# Altium project VS1053_Eink_MP3.PrjPcb
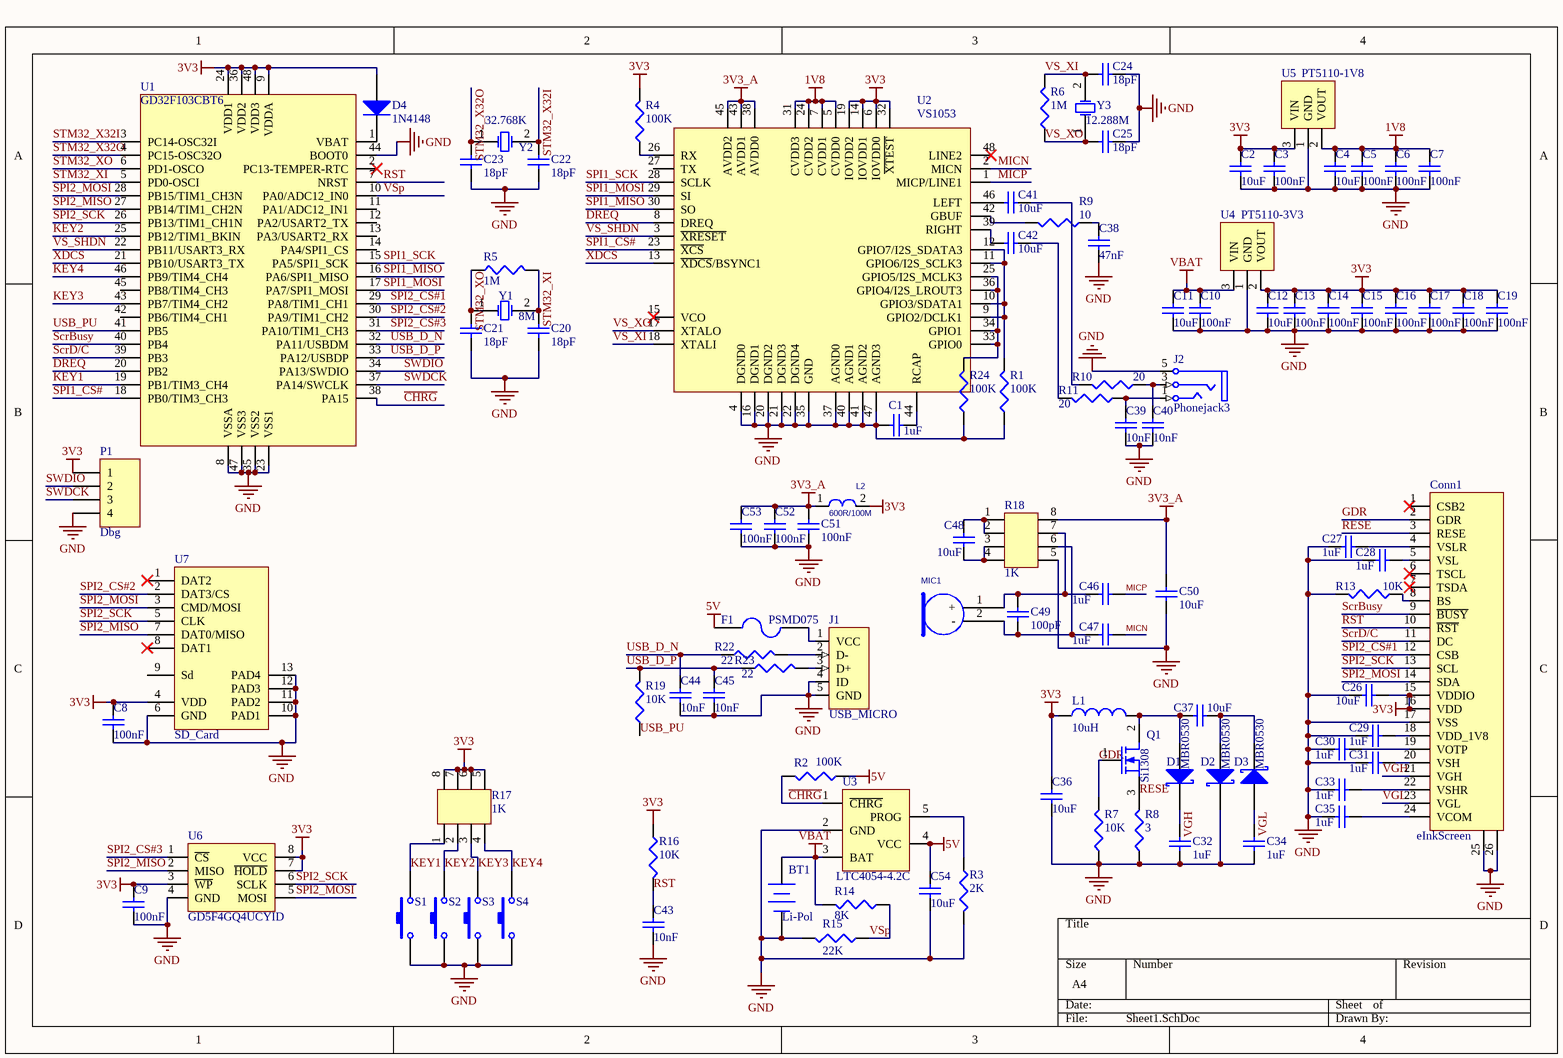
[diagram p0: Sheet1.SchDoc]
1 sheet, 103 parts. Net scope: global (net labels, ports and power ports of the same name join across sheets).
Board file: PCB1.PcbDoc

## Sheet Sheet1.SchDoc
size A4

### Parts
BT1  Li-Pol  [BAT-2]
C1  value 1uF  [0603C]  (hidden comment: Cap)
C2  value 10uF  [0603C]  (hidden comment: Cap)
C3  value 100nF  [0603C]  (hidden comment: Cap)
C4  value 10uF  [0603C]  (hidden comment: Cap)
C5  value 100nF  [0603C]  (hidden comment: Cap)
C6  value 100nF  [0603C]  (hidden comment: Cap)
C7  value 100nF  [0603C]  (hidden comment: Cap)
C8  value 100nF  [0603C]  (hidden comment: Cap)
C9  value 100nF  [0603C]  (hidden comment: Cap)
C10  value 100nF  [0603C]  (hidden comment: Cap)
C11  value 10uF  [0603C]  (hidden comment: Cap)
C12  value 10uF  [0603C]  (hidden comment: Cap)
C13  value 100nF  [0603C]  (hidden comment: Cap)
C14  value 100nF  [0603C]  (hidden comment: Cap)
C15  value 100nF  [0603C]  (hidden comment: Cap)
C16  value 100nF  [0603C]  (hidden comment: Cap)
C17  value 100nF  [0603C]  (hidden comment: Cap)
C18  value 100nF  [0603C]  (hidden comment: Cap)
C19  value 100nF  [0603C]  (hidden comment: Cap)
C20  value 18pF  [0603C]  (hidden comment: Cap)
C21  value 18pF  [0603C]  (hidden comment: Cap)
C22  value 18pF  [0603C]  (hidden comment: Cap)
C23  value 18pF  [0603C]  (hidden comment: Cap)
C24  value 18pF  [0603C]  (hidden comment: Cap)
C25  value 18pF  [0603C]  (hidden comment: Cap)
C26  value 10uF  [0603C]  (hidden comment: Cap)
C27  value 1uF  [0603C]  (hidden comment: Cap)
C28  value 1uF  [0603C]  (hidden comment: Cap)
C29  value 1uF  [0603C]  (hidden comment: Cap)
C30  value 1uF  [0603C]  (hidden comment: Cap)
C31  value 1uF  [0603C]  (hidden comment: Cap)
C32  value 1uF  [0603C]  (hidden comment: Cap)
C33  value 1uF  [0603C]  (hidden comment: Cap)
C34  value 1uF  [0603C]  (hidden comment: Cap)
C35  value 1uF  [0603C]  (hidden comment: Cap)
C36  value 10uF  [0603C]  (hidden comment: Cap)
C37  value 10uF  [0603C]  (hidden comment: Cap)
C38  value 47nF  [0603C]  (hidden comment: Cap)
C39  value 10nF  [0603C]  (hidden comment: Cap)
C40  value 10nF  [0603C]  (hidden comment: Cap)
C41  value 10uF  [0603C]  (hidden comment: Cap)
C42  value 10uF  [0603C]  (hidden comment: Cap)
C43  value 10nF  [0603C]  (hidden comment: Cap)
C44  value 10nF  [0603C]  (hidden comment: Cap)
C45  value 10nF  [0603C]  (hidden comment: Cap)
C46  value 1uF  [0603C]  (hidden comment: Cap)
C47  value 1uF  [0603C]  (hidden comment: Cap)
C48  value 10uF  [0603C]  (hidden comment: Cap)
C49  value 100pF  [0603C]  (hidden comment: Cap)
C50  value 10uF  [0603C]  (hidden comment: Cap)
C51  value 100nF  [0603C]  (hidden comment: Cap)
C52  value 100nF  [0603C]  (hidden comment: Cap)
C53  value 100nF  [0603C]  (hidden comment: Cap)
C54  value 10uF  [0603C]  (hidden comment: Cap)
Conn1  eInkScreen  [FPC-24P-0.5]
D1  MBR0530  [SOD123]
D2  MBR0530  [SOD123]
D3  MBR0530  [SOD123]
D4  1N4148  [0805LED2]
F1  PSMD075  [0805-1R]
J1  USB_MICRO  [MicroUSB]
J2  Phonejack3  [PJ-320B]
L1  value 10uH  [1210R]  (hidden comment: Inductor)
L2  600R/100M  [L0603]
MIC1  Micphone  [mic_4015]  (value not drawn)
P1  Dbg  [HDR1X4]
Q1  Si1308  [SOT323-N]
R1  value 100K  [0603R]  (hidden comment: Res3)
R2  value 100K  [0603R]  (hidden comment: Res3)
R3  value 2K  [0603R]  (hidden comment: Res3)
R4  value 100K  [0603R]  (hidden comment: Res3)
R5  value 1M  [0603R]  (hidden comment: Res3)
R6  value 1M  [0603R]  (hidden comment: Res3)
R7  value 10K  [0603R]  (hidden comment: Res3)
R8  value 3  [0603R]  (hidden comment: Res3)
R9  value 10  [0603R]  (hidden comment: Res3)
R10  value 20  [0603R]  (hidden comment: Res3)
R11  value 20  [0603R]  (hidden comment: Res3)
R13  value 10K  [0603R]  (hidden comment: Res3)
R14  value 8K  [0603R]  (hidden comment: Res3)
R15  value 22K  [0603R]  (hidden comment: Res3)
R16  value 10K  [0603R]  (hidden comment: Res3)
R17  1K  [YC164]
R18  1K  [YC164]
R19  value 10K  [0603R]  (hidden comment: Res3)
R22  value 22  [0603R]  (hidden comment: Res3)
R23  value 22  [0603R]  (hidden comment: Res3)
R24  value 100K  [0603R]  (hidden comment: Res3)
S1  SW-PB  [SPST-2]  (value not drawn)
S2  SW-PB  [SPST-2]  (value not drawn)
S3  SW-PB  [SPST-2]  (value not drawn)
S4  SW-PB  [SPST-2]  (value not drawn)
U1  GD32F103CBT6  [LQFP48-7x7]
U2  VS1053  [LQFP48-7x7]
U3  LTC4054-4.2C  [SOT23-5]
U4  PT5110-3V3  [SOT23]
U5  PT5110-1V8  [SOT23]
U6  GD5F4GQ4UCYID  [TSOP8+WSON8-6X5]
U7  SD_Card  [TF_self-eject]
Y1  8M  [XTAL-5032]
Y2  32.768K  [XTAL-3215]
Y3  12.288M  [XTAL-5032]

### Nets
1V8: C4.1 C5.1 C6.1 C7.1 U2.5(CVDD0) U2.7(CVDD1) U2.24(CVDD2) U2.31(CVDD3) U5.2(VOUT)
3V3: C2.1 C3.1 C8.1 C9.2 C12.2 C13.2 C14.2 C15.2 C16.2 C17.2 C18.2 C19.2 C26.2 C36.2 Conn1.15(VDDIO) Conn1.16(VDD) D4.1(A) L1.1 L2.2 P1.1 R4.2 R16.1 R17.5 R17.6 R17.7 R17.8 U1.9(VDDA) U1.24(VDD1) U1.36(VDD2) U1.48(VDD3) U2.6(IOVDD0) U2.14(IOVDD1) U2.19(IOVDD2) U2.32(~{XTEST}) U4.2(VOUT) U5.3(VIN) U6.3(~{WP}) U6.7(~{HOLD}) U6.8(VCC) U7.4(VDD)
3V3_A: C50.2 C51.2 C52.2 C53.2 L2.1 R18.8 U2.38(AVDD0) U2.43(AVDD1) U2.45(AVDD2)
5V: C54.2 F1.1 R2.1 U3.4(VCC)
GND: BT1.2(-) C1.1 C2.2 C3.2 C4.2 C5.2 C6.2 C7.2 C8.2 C9.1 C10.1 C11.1 C12.1 C13.1 C14.1 C15.1 C16.1 C17.1 C18.1 C19.1 C20.2 C21.2 C22.2 C23.2 C24.2 C25.2 C26.1 C27.1 C28.1 C29.1 C30.1 C31.1 C32.1 C33.1 C34.1 C35.1 C36.1 C38.1 C39.1 C40.1 C43.1 C44.1 C45.1 C50.1 C51.1 C52.1 C53.1 C54.1 Conn1.17(VSS) Conn1.25 Conn1.26 D2.2(K) J1.4(ID) J1.5(GND) J2.5(S) P1.4 R1.1 R3.2 R7.1 R8.1 R13.2 R15.2 R18.5 R24.1 S1.1 S2.1 S3.1 S4.1 U1.8(VSSA) U1.23(VSS1) U1.35(VSS2) U1.44(BOOT0) U1.47(VSS3) U2.4(DGND0) U2.16(DGND1) U2.20(DGND2) U2.21(DGND3) U2.22(DGND4) U2.35(GND) U2.37(AGND0) U2.40(AGND1) U2.41(AGND2) U2.47(AGND3) U3.2(GND) U4.1(GND) U5.1(GND) U6.4(GND) U7.6(GND) U7.10(PAD1) U7.11(PAD2) U7.12(PAD3) U7.13(PAD4)
VBAT: BT1.1(+) C10.2 C11.2 R14.2 U3.3(BAT) U4.3(VIN)
~{CHRG}: R2.2 U1.38(PA15) U3.1(~{CHRG})
DREQ: U1.20(PB2) U2.8(DREQ)
GDR: Conn1.2(GDR) Q1.1(G) R7.2
KEY1: R17.1 S1.2 U1.19(PB1/TIM3_CH4)
KEY2: R17.2 S2.2 U1.25(PB12/TIM1_BKIN)
KEY3: R17.3 S3.2 U1.43(PB7/TIM4_CH2)
KEY4: R17.4 S4.2 U1.46(PB9/TIM4_CH4)
MICN: C47.1 U2.2(MICN)
MICP: C46.1 U2.1(MICP/LINE1)
RESE: Conn1.3(RESE) Q1.3 R8.2
RST: C43.2 Conn1.10(~{RST}) R16.2 U1.7(NRST)
ScrBusy: Conn1.9(~{BUSY}) U1.40(PB4)
ScrD/C: Conn1.11(DC) U1.39(PB3)
SPI1_CS#: U1.18(PB0/TIM3_CH3) U2.23(~{XCS})
SPI1_MISO: U1.16(PA6/SPI1_MISO) U2.30(SO)
SPI1_MOSI: U1.17(PA7/SPI1_MOSI) U2.29(SI)
SPI1_SCK: U1.15(PA5/SPI1_SCK) U2.28(SCLK)
SPI2_CS#1: Conn1.12(CSB) U1.29(PA8/TIM1_CH1)
SPI2_CS#2: U1.30(PA9/TIM1_CH2) U7.2(DAT3/CS)
SPI2_CS#3: U1.31(PA10/TIM1_CH3) U6.1(~{CS})
SPI2_MISO: U1.27(PB14/TIM1_CH2N) U6.2(MISO) U7.7(DAT0/MISO)
SPI2_MOSI: Conn1.14(SDA) U1.28(PB15/TIM1_CH3N) U6.5(MOSI) U7.3(CMD/MOSI)
SPI2_SCK: Conn1.13(SCL) U1.26(PB13/TIM1_CH1N) U6.6(SCLK) U7.5(CLK)
STM32_X32I: C22.1 U1.3(PC14-OSC32I) Y2.2(OSC2)
STM32_X32O: C23.1 U1.4(PC15-OSC32O) Y2.1(OSC1)
STM32_XI: C20.1 R5.2 U1.5(PD0-OSCI) Y1.2(OSC2)
STM32_XO: C21.1 R5.1 U1.6(PD1-OSCO) Y1.1(OSC1)
SWDCK: P1.3 U1.37(PA14/SWCLK)
SWDIO: P1.2 U1.34(PA13/SWDIO)
USB_D_N: C44.2 R22.1 U1.32(PA11/USBDM)
USB_D_P: C45.2 R19.2 R23.1 U1.33(PA12/USBDP)
USB_PU: R19.1 U1.41(PB5)
VGH: C32.2 Conn1.21(VGH) D1.2(K)
VGL: C34.2 Conn1.23(VGL) D3.1(A)
VS_SHDN: U1.22(PB11/USART3_RX) U2.3(~{XRESET})
VS_XI: C24.1 R6.2 U2.18(XTALI) Y3.2(OSC2)
VS_XO: C25.1 R6.1 U2.17(XTALO) Y3.1(OSC1)
VSp: R14.1 R15.1 U1.10(PA0/ADC12_IN0)
XDCS: U1.21(PB10/USART3_TX) U2.13(~{XDCS}/BSYNC1)
NetC1_2: C1.2 U2.44(RCAP)
NetC27_2: C27.2 Conn1.4(VSLR)
NetC28_2: C28.2 Conn1.5(VSL)
NetC29_2: C29.2 Conn1.18(VDD_1V8)
NetC30_2: C30.2 Conn1.19(VOTP)
NetC31_2: C31.2 Conn1.20(VSH)
NetC33_2: C33.2 Conn1.22(VSHR)
NetC35_2: C35.2 Conn1.24(VCOM)
NetC37_1: C37.1 D2.1(A) D3.2(K)
NetC37_2: C37.2 D1.1(A) L1.2 Q1.2
NetC38_2: C38.2 R9.1
NetC39_2: C39.2 J2.1(T) R11.1
NetC40_2: C40.2 J2.3(R) R10.1
NetC41_1: C41.1 R10.2
NetC41_2: C41.2 U2.46(LEFT)
NetC42_1: C42.1 R11.2
NetC42_2: C42.2 U2.39(RIGHT)
NetC46_2: C46.2 C49.2 MIC1.1(+) R18.7
NetC47_2: C47.2 C49.1 MIC1.2(-) R18.6
NetC48_1: C48.1 R18.3 R18.4
NetC48_2: C48.2 R18.1 R18.2
NetConn1_8: Conn1.8(BS) R13.1
NetD4_2: D4.2(K) U1.1(VBAT)
NetF1_2: F1.2 J1.1(VCC)
NetJ1_2: J1.2(D-) R22.2
NetJ1_3: J1.3(D+) R23.2
NetR1_2: R1.2 U2.9(GPIO2/DCLK1) U2.10(GPIO3/SDATA1) U2.11(GPIO6/I2S_SCLK3) U2.12(GPIO7/I2S_SDATA3)
NetR3_1: R3.1 U3.5(PROG)
NetR4_1: R4.1 U2.26(RX)
NetR9_2: R9.2 U2.42(GBUF)
NetR24_2: R24.2 U2.25(GPIO5/I2S_MCLK3) U2.33(GPIO0) U2.34(GPIO1) U2.36(GPIO4/I2S_LROUT3)

Not connected (* = marked no-connect by the designer): Conn1 1(CSB2)* 6(TSCL)* 7(TSDA)*; U1 2(PC13-TEMPER-RTC)* 11(PA1/ADC12_IN1) 12(PA2/USART2_TX) 13(PA3/USART2_RX) 14(PA4/SPI1_CS) 42(PB6/TIM4_CH1) 45(PB8/TIM4_CH3); U2 15(VCO)* 27(TX) 48(LINE2)*; U7 1(DAT2)* 8(DAT1)* 9(Sd)

### Library data of the parts
BT1 = Battery: Multicell Battery; Published: 24-Mar-1999; LatestRevisionDate: 17-Jul-2002; LatestRevisionNote: Re-released for DXP Platform.; PackageReference: BAT-2; Publisher: Altium Limited; PackageDescription: Battery; 2 Leads
C1-C54 = Cap: Capacitor; Published: 8-Jun-2000; LatestRevisionDate: 17-Jul-2002; LatestRevisionNote: Re-released for DXP Platform.; PackageReference: RAD-0.3; Publisher: Altium Limited; PackageDescription: Radial Cap, Thru-Hole; 2 Leads; 0.3 in Pin Spacing
Conn1 = eINK_FPC24
D1-D3 = D Schottky: Schottky Diode; Published: 8-Jun-2000; LatestRevisionDate: 17-Jul-2002; LatestRevisionNote: Re-released for DXP Platform.; PackageReference: SMB; Publisher: Altium Limited; PackageDescription: DO-214-AA/SMB; 2 C-Bend Leads; Body 5.3 x 3.6 mm, inc. leads (LxW); Code_JEDEC: DO-214-AA
D4 = Diode 1N4148: High Conductance Fast Diode; Published: 8-Jun-2000; LatestRevisionDate: 17-Jul-2002; LatestRevisionNote: Re-released for DXP Platform.; DatasheetVersion: 1997; PackageReference: DO-35; Publisher: Altium Limited; PackageDescription: Diode, Axial; Body 3.8 x 1.9 mm (LxDia. max), Lead Dia. 0.53 mm (max); Code_JEDEC: DO-204-AH; ComponentLink1Description: Manufacturer Link; ComponentLink1URL: http://www.fairchildsemi.com/; ComponentLink2Description: Datasheet; ComponentLink2URL: http://www.fairchildsemi.com/ds/1N%2F1N4148.pdf
F1 = Fuse 2: Fuse; Published: 8-Jun-2000; LatestRevisionDate: 17-Jul-2002; LatestRevisionNote: Re-released for DXP Platform.; PackageReference: PIN-W2/E2.8; Publisher: Altium Limited; PackageDescription: Thru-Hole; 2 Leads
J2 = Phonejack3: Jack Socket, 1/4" [6.5mm], Thru-Hole, Vertical, 3-Conductor Open Circuit (Non-Normalling); PackageDocument: 2003; PCB_Layout: Complies with manufacturer's recommendation.; DrillAndSlotSize: Corresponds to nominal value.; Published: 15-Jul-2004; LatestRevisionDate: 15-Jul-2004; LatestRevisionNote: Component Replaced.; DatasheetDocument: 2003; PackageReference: S1VS_SSS; Publisher: Altium Limited; ComponentLink1Description: Manufacturer Link; ComponentLink1URL: http://www.cliffuk.co.uk/
L1 = Inductor: Code_IEC: 1005; Published: 8-Jun-2000; LatestRevisionDate: 29-May-2009; LatestRevisionNote: IPC-7351 Footprint Added.; PackageReference: 0402-A; Publisher: Altium Limited; PackageDescription: Chip Inductor; Code_JEITA: 0402
L2 = INDUCTOR_0_Dup1: RoHS BEAD/600ohm 100Mhz Z=600Ω DCR<0.2Ω 800mA SMT L0603; OriginalSymbolOrigin: (10,0); Pin Numbers Visible: TRUE; Pin Names Visible: FALSE; Package: SMT; Pin Names Rotate: TRUE
MIC1 = Micphone_0: mypage: 13
P1 = Header 4: Header, 4-Pin; LatestRevisionDate: 17-Jul-2002; LatestRevisionNote: Re-released for DXP Platform.; Publisher: Altium Limited
Q1 = PwrMOS_N
R1-R11 R13-R16 R19 R22-R24 = Res3: Resistor; Published: 8-Jun-2000; LatestRevisionDate: 29-May-2009; LatestRevisionNote: IPC-7351 Footprint Added.; PackageReference: J1-0603; Publisher: Altium Limited; PackageDescription: Chip Resistor
R17 R18 = ResPak-8P4R
S1-S4 = SW-PB: Switch; Published: 24-Mar-1999; LatestRevisionDate: 17-Jul-2002; LatestRevisionNote: Re-released for DXP Platform.; PackageReference: SPST-2; Publisher: Altium Limited; PackageDescription: Switch; 2 Leads
U1 = STM32F103CxT6
U3 = LTC4054
U4 U5 = PT5110
U6 = W25Qxx
Y1-Y3 = XTAL: Crystal Oscillator; Published: 8-Jun-2000; LatestRevisionDate: 17-Jul-2002; LatestRevisionNote: Re-released for DXP Platform.; PackageReference: R38; Publisher: Altium Limited; PackageDescription: Crystal, Thru-Hole; 2 Leads; Body 3.1 x 8.2 mm (Dia.xH)